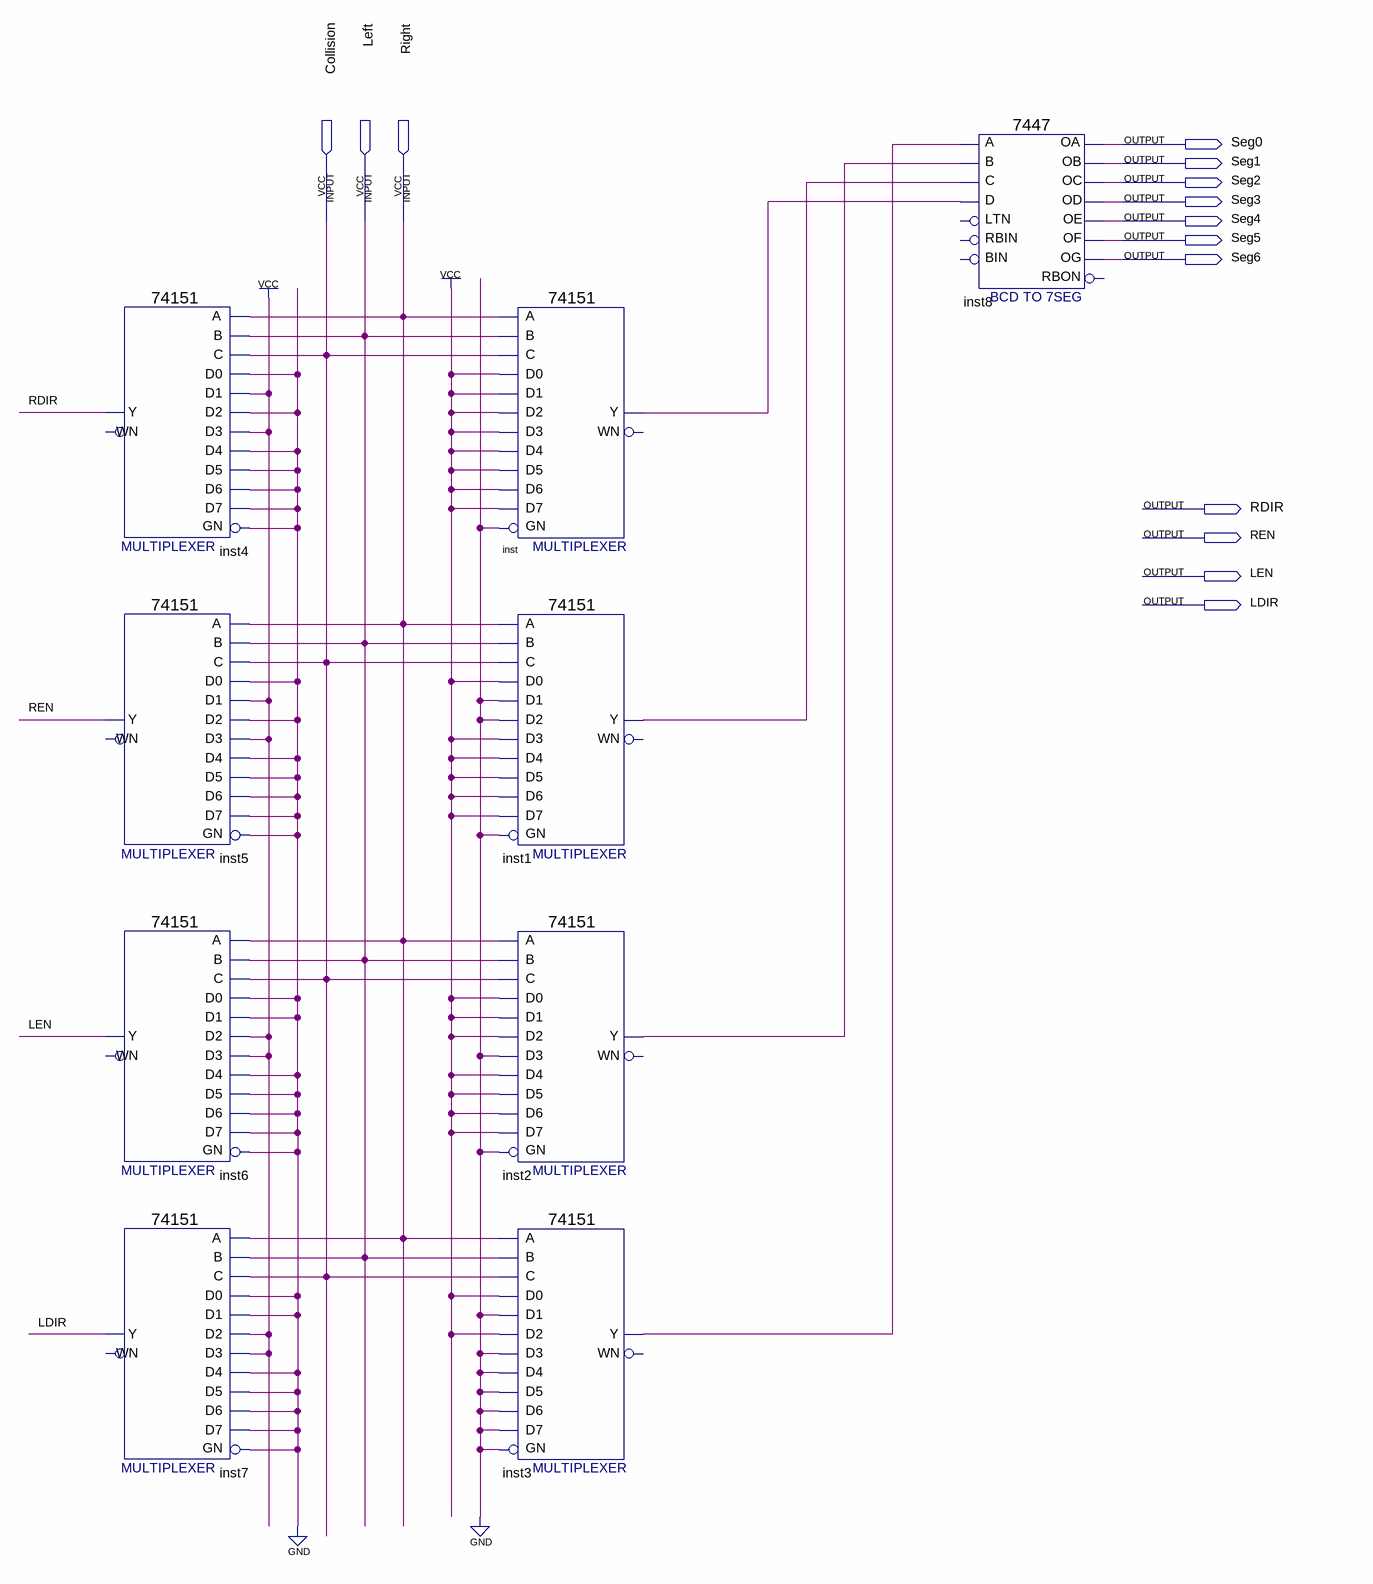
[diagram p0: schematic sheet]
// Quartus schematic digibot3.bdf as structural Verilog: 9 symbols, 14 pins
module digibot3 (
  input  Collision,
  input  Left,
  input  Right,
  output Seg0,
  output Seg1,
  output Seg2,
  output Seg3,
  output Seg4,
  output Seg5,
  output Seg6,
  output RDIR,
  output REN,
  output LEN,
  output LDIR
);

  wire inst1_y, inst2_y, inst3_y, inst_y;

  \74151  inst4 (
    .GN(1'b0), .C(Collision), .B(Left), .A(Right), .D5(1'b0), .D0(1'b0), .D1(1'b1), .D4(1'b0), .D3(1'b1),
    .D2(1'b0), .D6(1'b0), .D7(1'b0), .Y(RDIR));  // open: WN
  \74151  inst5 (
    .GN(1'b0), .C(Collision), .B(Left), .A(Right), .D5(1'b0), .D0(1'b0), .D1(1'b1), .D4(1'b0), .D3(1'b1),
    .D2(1'b0), .D6(1'b0), .D7(1'b0), .Y(REN));  // open: WN
  \74151  inst6 (
    .GN(1'b0), .C(Collision), .B(Left), .A(Right), .D5(1'b0), .D0(1'b0), .D1(1'b0), .D4(1'b0), .D3(1'b1),
    .D2(1'b1), .D6(1'b0), .D7(1'b0), .Y(LEN));  // open: WN
  \74151  inst7 (
    .GN(1'b0), .C(Collision), .B(Left), .A(Right), .D5(1'b0), .D0(1'b0), .D1(1'b0), .D4(1'b0), .D3(1'b1),
    .D2(1'b1), .D6(1'b0), .D7(1'b0), .Y(LDIR));  // open: WN
  \74151  inst (
    .GN(1'b0), .C(Collision), .B(Left), .A(Right), .D5(1'b1), .D0(1'b1), .D1(1'b1), .D4(1'b1), .D3(1'b1),
    .D2(1'b1), .D6(1'b1), .D7(1'b1), .Y(inst_y));  // open: WN
  \74151  inst1 (
    .GN(1'b0), .C(Collision), .B(Left), .A(Right), .D5(1'b1), .D0(1'b1), .D1(1'b0), .D4(1'b1), .D3(1'b1),
    .D2(1'b0), .D6(1'b1), .D7(1'b1), .Y(inst1_y));  // open: WN
  \74151  inst2 (
    .GN(1'b0), .C(Collision), .B(Left), .A(Right), .D5(1'b1), .D0(1'b1), .D1(1'b1), .D4(1'b1), .D3(1'b0),
    .D2(1'b1), .D6(1'b1), .D7(1'b1), .Y(inst2_y));  // open: WN
  \74151  inst3 (
    .GN(1'b0), .C(Collision), .B(Left), .A(Right), .D5(1'b0), .D0(1'b1), .D1(1'b0), .D4(1'b0), .D3(1'b0),
    .D2(1'b1), .D6(1'b0), .D7(1'b0), .Y(inst3_y));  // open: WN
  \7447  inst8 (
    .B(inst2_y), .C(inst1_y), .D(inst_y), .A(inst3_y), .OB(Seg1), .OC(Seg2), .OE(Seg4), .OD(Seg3), .OF(Seg5),
    .OG(Seg6), .OA(Seg0));  // open: LTN, RBIN, BIN, RBON
endmodule
